# Altium schematic sheet TEMP.SchDoc
size 420 x 297 mm; SheetNumber: 18; SheetTotal: 34
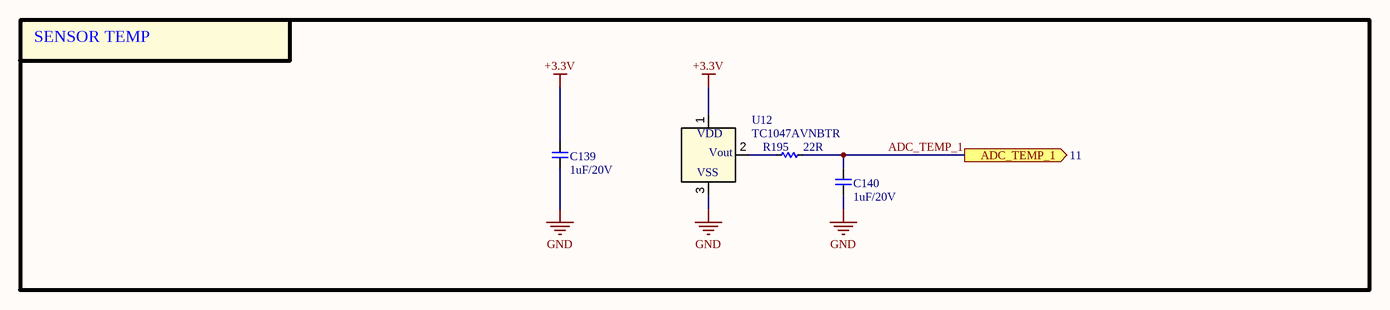
[diagram p0: TEMP.SchDoc]

## Parts
C139  1uF/20V  [CAP_C_1005X50_L]
C140  1uF/20V  [CAP_C_1005X50_L]
R195  22R  [RES_C_1005x30_L]
U12  TC1047AVNBTR  [SOT-23_MC_MCH]

## Blocks framed on the sheet
SENSOR TEMP: C139 C140 R195 U12

## Ports
ADC_TEMP_1 (out, see 11)

## Nets
+3.3V: C139.2 U12.1(VDD)
GND: C139.1 C140.1 U12.3(VSS)
ADC_TEMP_1: C140.2 R195.2 ; port ADC_TEMP_1
NetR195_1: R195.1 U12.2(VOUT)

## Notes on the sheet
- Project:
- Sub-system:
- Design by:
- Sheet title:
- Sheet
- of
- Checked by:
- Approved by:
- Revision:
- Document No:
- Size:
- Date:
- A3
- (in symbol TC1047AVNBTR) Vout

## Library data of the parts
C139 C140 = _CAP_C_2: CAP CHIP
R195 = _RES_B_2: RES
U12 = TC1047AVNBTR: SENSOR ANALOG -40C-125C SOT23-3; Manufacturer_Name: Microchip; Copyright: Copyright (C) 2025 Ultra Librarian. All rights reserved.; Manufacturer_Part_Number: TC1047AVNBTR; RefDes: RefDes; Type: Type